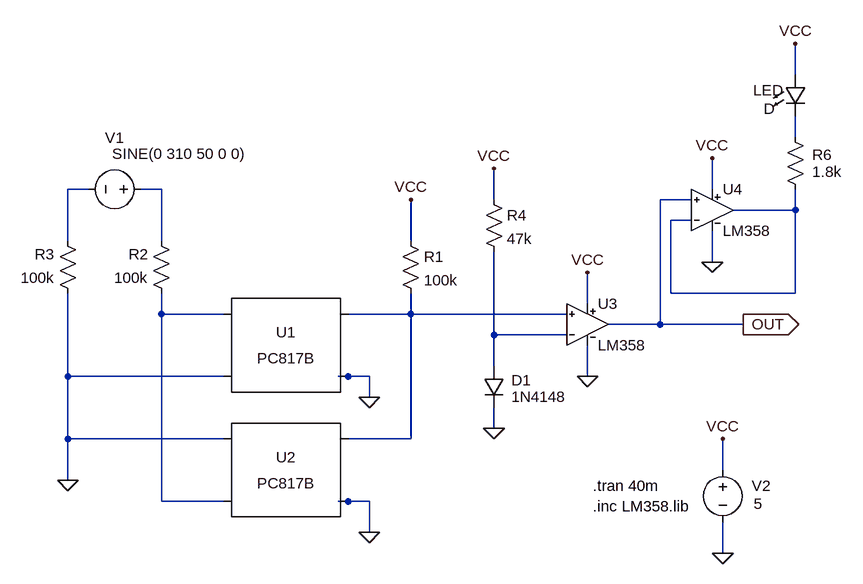
[diagram p0: schematic v2.1.asc]
v2.1.asc, the LTspice schematic file:
Version 4.1
SHEET 1 1536 680
WIRE 1008 -256 1008 -304
WIRE 1008 -160 1008 -192
WIRE -80 -80 -112 -80
WIRE 32 -80 0 -80
WIRE 880 -80 880 -128
WIRE 544 -64 544 -112
WIRE 848 -64 800 -64
WIRE 1008 -48 1008 -80
WIRE 1008 -48 912 -48
WIRE 848 -32 816 -32
WIRE -112 0 -112 -80
WIRE 32 0 32 -80
WIRE 416 0 416 -64
WIRE 880 32 880 -16
WIRE 816 80 816 -32
WIRE 1008 80 1008 -48
WIRE 1008 80 816 80
WIRE 688 96 688 48
WIRE 32 112 32 80
WIRE 128 112 32 112
WIRE 416 112 416 80
WIRE 416 112 320 112
WIRE 656 112 416 112
WIRE 800 128 800 -64
WIRE 800 128 720 128
WIRE 928 128 800 128
WIRE 544 144 544 16
WIRE 656 144 544 144
WIRE 544 192 544 144
WIRE -112 208 -112 80
WIRE 128 208 -112 208
WIRE 320 208 304 208
WIRE 352 208 320 208
WIRE 688 208 688 160
WIRE 352 240 352 208
WIRE 544 288 544 256
WIRE -112 304 -112 208
WIRE 128 304 -112 304
WIRE 416 304 416 112
WIRE 416 304 320 304
WIRE 896 352 896 304
WIRE -112 368 -112 304
WIRE 32 400 32 112
WIRE 128 400 32 400
WIRE 320 400 304 400
WIRE 352 400 320 400
WIRE 352 448 352 400
WIRE 896 480 896 432
FLAG 896 480 0
FLAG 352 448 0
FLAG 896 304 VCC
FLAG 416 -64 VCC
FLAG 352 240 0
FLAG -112 368 0
FLAG 544 288 0
FLAG 544 -112 VCC
FLAG 928 128 OUT
IOPIN 928 128 Out
FLAG 688 48 VCC
FLAG 688 208 0
FLAG 880 -128 VCC
FLAG 880 32 0
FLAG 1008 -304 VCC
SYMBOL Optos\\PC817B 224 160 R0
SYMATTR InstName U1
SYMBOL res 400 -16 R0
SYMATTR InstName R1
SYMATTR Value 100k
SYMBOL voltage 16 -80 R90
WINDOW 123 0 0 Left 0
WINDOW 39 0 0 Left 0
WINDOW 0 -79 41 VRight 2
WINDOW 3 -55 -147 VRight 2
SYMATTR InstName V1
SYMATTR Value SINE(0 310 50 0 0)
SYMBOL res 48 96 R180
WINDOW 0 36 76 Left 2
WINDOW 3 36 40 Left 2
SYMATTR InstName R2
SYMATTR Value 100k
SYMBOL voltage 896 336 R0
WINDOW 123 0 0 Left 0
WINDOW 39 0 0 Left 0
WINDOW 0 45 40 Left 2
WINDOW 3 48 68 Left 2
SYMATTR InstName V2
SYMATTR Value 5
SYMBOL res -96 96 R180
WINDOW 0 36 76 Left 2
WINDOW 3 36 40 Left 2
SYMATTR InstName R3
SYMATTR Value 100k
SYMBOL Optos\\PC817B 224 352 R0
SYMATTR InstName U2
SYMBOL diode 528 192 R0
WINDOW 0 43 22 Left 2
WINDOW 3 43 47 Left 2
SYMATTR InstName D1
SYMATTR Value 1N4148
SYMBOL res 528 -80 R0
SYMATTR InstName R4
SYMATTR Value 47k
SYMBOL Extra\\LM358 688 64 R0
SYMATTR InstName U3
SYMBOL Extra\\LM358 880 -112 R0
SYMATTR InstName U4
SYMBOL res 1024 -64 R180
WINDOW 0 -41 69 Left 2
WINDOW 3 -56 43 Left 2
SYMATTR InstName R6
SYMATTR Value 1.8k
SYMBOL LED 992 -256 R0
WINDOW 0 -49 24 Left 2
WINDOW 3 -33 52 Left 2
SYMATTR InstName LED
TEXT 696 376 Left 2 !.tran 40m
TEXT 696 408 Left 2 !.inc LM358.lib

The netlist it stands for:
* v2.1.asc
X§U1 N005 0 N006 0 PC817 Igain=1.5m
R1 VCC N006 100k
V1 N003 N002 SINE(0 310 50 0 0)
R2 N005 N003 100k
V2 VCC 0 5
R3 0 N002 100k
X§U2 0 N005 N006 0 PC817 Igain=1.5m
D1 N007 0 1N4148
R4 VCC N007 47k
X§U3 N007 N006 OUT VCC 0 LM358  ; pins In- In+ OUT V+ V-
X§U4 N004 OUT N004 VCC 0 LM358  ; pins In- In+ OUT V+ V-
R6 N004 N001 1.8k
D§LED VCC N001 D
.model D D
.lib standard.dio
.tran 40m
.inc LM358.lib
.lib PC817.sub
.lib MyLib/OpAmp/LM358.lib
.backanno
.end